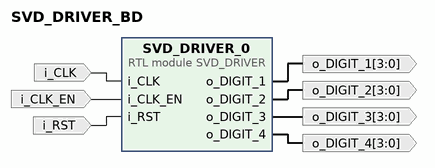
[diagram p0: block diagram of the top level]
# Vivado block design SVD_DRIVER_BD, xc7z007sclg400-1, Vivado 2018.3
create_bd_design SVD_DRIVER_BD

create_bd_port -dir I -type clk i_CLK
create_bd_port -dir O -from 3 -to 0 o_DIGIT_4
create_bd_port -dir I i_CLK_EN
create_bd_port -dir O -from 3 -to 0 o_DIGIT_3
create_bd_port -dir I -type rst i_RST
set_property -dict {CONFIG.POLARITY ACTIVE_LOW} [get_bd_ports i_RST]
create_bd_port -dir O -from 3 -to 0 o_DIGIT_2
create_bd_port -dir O -from 3 -to 0 o_DIGIT_1

create_bd_cell -type module -reference SVD_DRIVER SVD_DRIVER_0

# ---- connections ----

connect_bd_net -net i_CLK_0_1 [get_bd_ports i_CLK] [get_bd_pins SVD_DRIVER_0/i_CLK]
connect_bd_net [get_bd_pins SVD_DRIVER_0/o_DIGIT_4] [get_bd_ports o_DIGIT_4]
connect_bd_net -net i_CLK_EN_0_1 [get_bd_ports i_CLK_EN] [get_bd_pins SVD_DRIVER_0/i_CLK_EN]
connect_bd_net [get_bd_pins SVD_DRIVER_0/o_DIGIT_3] [get_bd_ports o_DIGIT_3]
connect_bd_net -net i_RST_0_1 [get_bd_ports i_RST] [get_bd_pins SVD_DRIVER_0/i_RST]
connect_bd_net [get_bd_pins SVD_DRIVER_0/o_DIGIT_2] [get_bd_ports o_DIGIT_2]
connect_bd_net [get_bd_pins SVD_DRIVER_0/o_DIGIT_1] [get_bd_ports o_DIGIT_1]

validate_bd_design
save_bd_design
